# Altium schematic sheet Wheatstone bridge part I (Main).SchDoc: Wheatstone bridge part I
size A4; Revision: 1; SheetNumber: 3; SheetTotal: 5; Units: mm
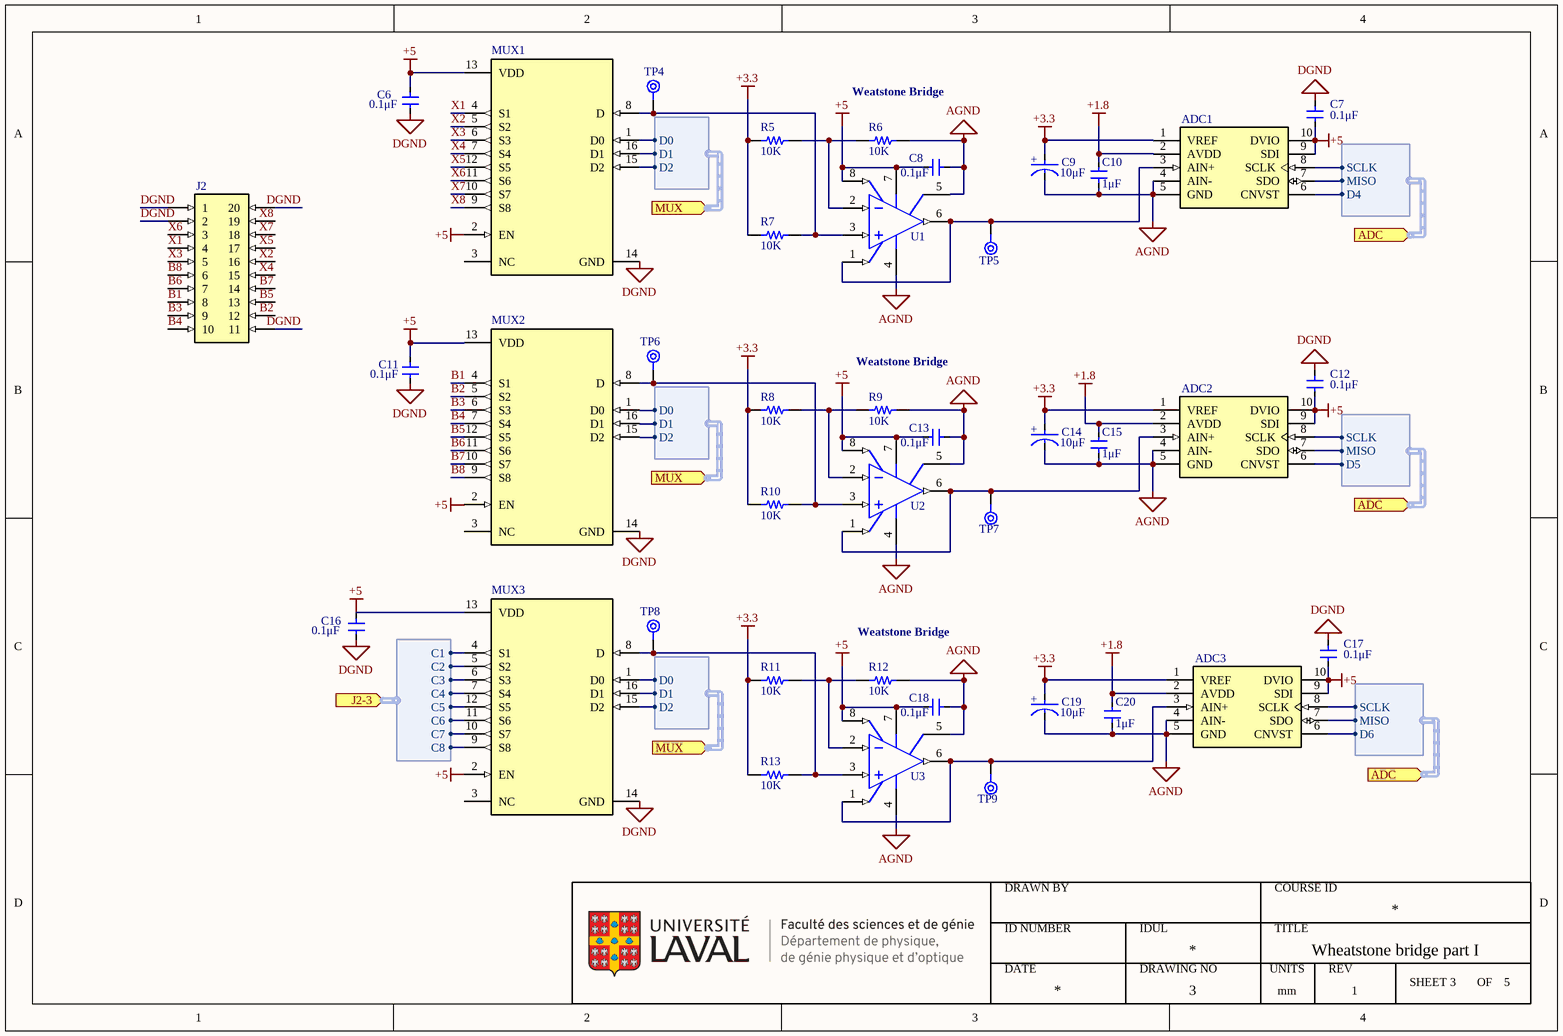
[diagram p0: Wheatstone bridge part I (Main).SchDoc]

## Parts
ADC1  (no value)  [MCP33141-10-E/MS]
ADC2  (no value)  [MCP33141-10-E/MS]
ADC3  (no value)  [MCP33141-10-E/MS]
C6  Capacitance: 0.1μF  [Cap Ceramic 0.1 uF 50V SMT 0603]  (hidden comment: CC0603JRX7R9BB104)
C7  Capacitance: 0.1μF  [Cap Ceramic 0.1 uF 50V SMT 0603]  (hidden comment: CC0603JRX7R9BB104)
C8  Capacitance: 0.1μF  [Cap Ceramic 0.1 uF 50V SMT 0603]  (hidden comment: CC0603JRX7R9BB104)
C9  value 10μF  [Cap Tantalum 10 uF 16V SMT 1411]  (hidden comment: Cap 10 uF 16V Tantalum 1411)
C10  value 1μF  [Cap Ceramic 1 uF 16V SMT 0603]  (hidden comment: CC0603KPX7R7BB105)
C11  Capacitance: 0.1μF  [Cap Ceramic 0.1 uF 50V SMT 0603]  (hidden comment: CC0603JRX7R9BB104)
C12  Capacitance: 0.1μF  [Cap Ceramic 0.1 uF 50V SMT 0603]  (hidden comment: CC0603JRX7R9BB104)
C13  Capacitance: 0.1μF  [Cap Ceramic 0.1 uF 50V SMT 0603]  (hidden comment: CC0603JRX7R9BB104)
C14  value 10μF  [Cap Tantalum 10 uF 16V SMT 1411]  (hidden comment: Cap 10 uF 16V Tantalum 1411)
C15  value 1μF  [Cap Ceramic 1 uF 16V SMT 0603]  (hidden comment: CC0603KPX7R7BB105)
C16  Capacitance: 0.1μF  [Cap Ceramic 0.1 uF 50V SMT 0603]  (hidden comment: CC0603JRX7R9BB104)
C17  Capacitance: 0.1μF  [Cap Ceramic 0.1 uF 50V SMT 0603]  (hidden comment: CC0603JRX7R9BB104)
C18  Capacitance: 0.1μF  [Cap Ceramic 0.1 uF 50V SMT 0603]  (hidden comment: CC0603JRX7R9BB104)
C19  value 10μF  [Cap Tantalum 10 uF 16V SMT 1411]  (hidden comment: Cap 10 uF 16V Tantalum 1411)
C20  value 1μF  [Cap Ceramic 1 uF 16V SMT 0603]  (hidden comment: CC0603KPX7R7BB105)
J2  BF050-20-A-B-0400-0300-L-G  [Headers 20 Pos TH 0.079" 4-3 - A]  (value not drawn)
MUX1  TMUX1208PWR  [TMUX1208PWR]  (value not drawn)
MUX2  TMUX1208PWR  [TMUX1208PWR]  (value not drawn)
MUX3  TMUX1208PWR  [TMUX1208PWR]  (value not drawn)
R5  value 10K  [Res 10K 0.1% SMT 0603]  (hidden comment: Res 10K SMT 0603)
R6  value 10K  [Res 10K 0.1% SMT 0603]  (hidden comment: Res 10K SMT 0603)
R7  value 10K  [Res 10K 0.1% SMT 0603]  (hidden comment: Res 10K SMT 0603)
R8  value 10K  [Res 10K 0.1% SMT 0603]  (hidden comment: Res 10K SMT 0603)
R9  value 10K  [Res 10K 0.1% SMT 0603]  (hidden comment: Res 10K SMT 0603)
R10  value 10K  [Res 10K 0.1% SMT 0603]  (hidden comment: Res 10K SMT 0603)
R11  value 10K  [Res 10K 0.1% SMT 0603]  (hidden comment: Res 10K SMT 0603)
R12  value 10K  [Res 10K 0.1% SMT 0603]  (hidden comment: Res 10K SMT 0603)
R13  value 10K  [Res 10K 0.1% SMT 0603]  (hidden comment: Res 10K SMT 0603)
TP4  Test Point  [SQ Pad]  (value not drawn)  (no BOM)
TP5  Test Point  [SQ Pad]  (value not drawn)  (no BOM)
TP6  Test Point  [SQ Pad]  (value not drawn)  (no BOM)
TP7  Test Point  [SQ Pad]  (value not drawn)  (no BOM)
TP8  Test Point  [SQ Pad]  (value not drawn)  (no BOM)
TP9  Test Point  [SQ Pad]  (value not drawn)  (no BOM)
U1  (no value)  [MCP6N11-100E/SN]
U2  (no value)  [MCP6N11-100E/SN]
U3  (no value)  [MCP6N11-100E/SN]

## Ports
ADC (in, harness 6), ADC (in, harness 7), ADC (in, harness 8), J2-3 (in, harness J2), MUX (in, harness 3), MUX (in, harness 4), MUX (in, harness 5)

## Harnesses
J2: C1, C2, C3, C4, C5, C6, C7, C8
4: D0, D1, D2
5: D0, D1, D2
3: D0, D1, D2
6: SCLK, MISO, D4
7: SCLK, MISO, D5
8: SCLK, MISO, D6

## Nets
+1.8: ADC1.2(AVDD) ADC2.2(AVDD) ADC3.2(AVDD) C10.1 C15.1 C20.1
+3.3: ADC1.1(VREF) ADC2.1(VREF) ADC3.1(VREF) C9.2(A) C14.2(A) C19.2(A) R5.1 R7.1 R8.1 R10.1 R11.1 R13.1
+5: ADC1.9(SDI) ADC1.10(DVIO) ADC2.9(SDI) ADC2.10(DVIO) ADC3.9(SDI) ADC3.10(DVIO) C6.2 C7.1 C8.1 C11.2 C12.1 C13.1 C16.2 C17.1 C18.1 MUX1.2(EN) MUX1.13(VDD) MUX2.2(EN) MUX2.13(VDD) MUX3.2(EN) MUX3.13(VDD) U1.7(VDD) U1.8(EN/~{CAL}) U2.7(VDD) U2.8(EN/~{CAL}) U3.7(VDD) U3.8(EN/~{CAL})
AGND: ADC1.4(AIN-) ADC1.5(GND) ADC2.4(AIN-) ADC2.5(GND) ADC3.4(AIN-) ADC3.5(GND) C8.2 C9.1(C) C10.2 C13.2 C14.1(C) C15.2 C18.2 C19.1(C) C20.2 R6.2 R9.2 R12.2 U1.4(VSS) U1.5(VREF) U2.4(VSS) U2.5(VREF) U3.4(VSS) U3.5(VREF)
DGND: C6.1 C7.2 C11.1 C12.2 C16.1 C17.2 J2.1 J2.2 J2.11 J2.20 MUX1.14(GND) MUX2.14(GND) MUX3.14(GND)
B1: J2.8 MUX2.4(S1)
B2: J2.12 MUX2.5(S2)
B3: J2.9 MUX2.6(S3)
B4: J2.10 MUX2.7(S4)
B5: J2.13 MUX2.12(S5)
B6: J2.7 MUX2.11(S6)
B7: J2.14 MUX2.10(S7)
B8: J2.6 MUX2.9(S8)
X1: J2.4 MUX1.4(S1)
X2: J2.16 MUX1.5(S2)
X3: J2.5 MUX1.6(S3)
X4: J2.15 MUX1.7(S4)
X5: J2.17 MUX1.12(S5)
X6: J2.3 MUX1.11(S6)
X7: J2.18 MUX1.10(S7)
X8: J2.19 MUX1.9(S8)
NetADC1_3: ADC1.3(AIN+) TP5.1(TP) U1.1(VFG) U1.6(VOUT)
NetADC1_6: ADC1.6(CNVST) ; port ADC.D4
NetADC1_7: ADC1.7(SDO) ADC2.7(SDO) ADC3.7(SDO) ; port ADC.MISO
NetADC1_8: ADC1.8(SCLK) ADC2.8(SCLK) ADC3.8(SCLK) ; port ADC.SCLK
NetADC2_3: ADC2.3(AIN+) TP7.1(TP) U2.1(VFG) U2.6(VOUT)
NetADC2_6: ADC2.6(CNVST) ; port ADC.D5
NetADC3_3: ADC3.3(AIN+) TP9.1(TP) U3.1(VFG) U3.6(VOUT)
NetADC3_6: ADC3.6(CNVST) ; port ADC.D6
NetMUX1_1: MUX1.1(D0) MUX2.1(D0) MUX3.1(D0) ; port MUX.D0
NetMUX1_8: MUX1.8(D) R7.2 TP4.1(TP) U1.3(VIP)
NetMUX1_15: MUX1.15(D2) MUX2.15(D2) MUX3.15(D2) ; port MUX.D2
NetMUX1_16: MUX1.16(D1) MUX2.16(D1) MUX3.16(D1) ; port MUX.D1
NetMUX2_8: MUX2.8(D) R10.2 TP6.1(TP) U2.3(VIP)
NetMUX3_4: MUX3.4(S1) ; port J2-3.C1
NetMUX3_5: MUX3.5(S2) ; port J2-3.C2
NetMUX3_6: MUX3.6(S3) ; port J2-3.C3
NetMUX3_7: MUX3.7(S4) ; port J2-3.C4
NetMUX3_8: MUX3.8(D) R13.2 TP8.1(TP) U3.3(VIP)
NetMUX3_9: MUX3.9(S8) ; port J2-3.C8
NetMUX3_10: MUX3.10(S7) ; port J2-3.C7
NetMUX3_11: MUX3.11(S6) ; port J2-3.C6
NetMUX3_12: MUX3.12(S5) ; port J2-3.C5
NetR5_2: R5.2 R6.1 U1.2(VIM)
NetR8_2: R8.2 R9.1 U2.2(VIM)
NetR11_2: R11.2 R12.1 U3.2(VIM)

Not connected (* = marked no-connect by the designer): MUX1 3(NC); MUX2 3(NC); MUX3 3(NC)

## Notes on the sheet
- (near R6) Weatstone Bridge
- (near R9) Weatstone Bridge
- (near R12) Weatstone Bridge
- DRAWN BY
- COURSE ID
- ID NUMBER
- DATE
- IDUL
- DRAWING NO
- TITLE
- UNITS
- REV
- SHEET
- OF
- (in symbol Cap 10 uF 16V Tantalum 1411) +

## Library data of the parts
ADC1-ADC3 = ADC 12 bits 1MSPS: 12 Bit Analog to Digital Converter 1 Input 1 SAR 10-MSOP; Supplier 1: Digi-Key; Supplier Part Number 1: MCP33141-10-E/MS-ND
C6-C8 C11-C13 C16-C18 = Cap Ceramic 0.1 uF SMT 0603: 0.1 µF ±5% 50V Ceramic Capacitor X7R 0603 (1608 Metric); manufacturer: Yageo; Part Number: CC0603JRX7R9BB104; Applications: General Purpose; componentlink1description: Datasheet; componentlink1url: https://www.yageo.com/upload/media/product/productsearch/datasheet/mlcc/UPY-GPHC_X7R_6.3V-to-50V_18.pdf; componentlink2description: DigiKey Link; componentlink2url: https://www.digikey.com/en/products/detail/yageo/CC0603JRX7R9BB104/5195188; Device Package: 0603 (1608 Metric); lastupdated: 2023-03-06 20:08:09; Lifecycle Status: Active; Minimum Order: 1; Mounting Type: Surface Mount, MLCC; Operating Temperature: -55°C ~ 125°C; Package / Case: 0603 (1608 Metric); packaging: TapeAndReel; partid: 12474; Part Status: Active; price: 0.01; series: CC; Size / Dimension: 0.063" L x 0.031" W (1.60mm x 0.80mm); Temperature Coefficient: X7R; Thickness (Max): 0.035" (0.90mm); Tolerance: ±5%; Voltage - Rated: 50V; Supplier 1: Digi-Key; Supplier Part Number 1: 311-1779-1-ND; Supplier 2: Digi-Key; Supplier Part Number 2: 311-1779-6-ND; Supplier 3: Digi-Key; Supplier Part Number 3: 311-1779-2-ND
C9 C14 C19 = Cap 10 uF 16V Tantalum 1411: 10 µF Molded Tantalum Capacitors 16 V 1411 (3528 Metric) 2Ohm; Voltage Rating: 16V; Case Code (Imperial): 1411; Supplier 1: Digi-Key; Supplier Part Number 1: 718-1124-1-ND; Supplier 2: Digi-Key; Supplier Part Number 2: 718-1124-6-ND; Supplier 3: Digi-Key; Supplier Part Number 3: 718-1124-2-ND
C10 C15 C20 = Cap Ceramic 1 uF SMT 0603: 1 µF ±10% 16V Ceramic Capacitor X7R 0603 (1608 Metric); Dielectric: XR7; Tolerance: 10%; Max Operating Temperature: 125°C; Case Code (Imperial): 0603; Voltage Rating (DC): 16V; Resistor Type: Ceramic; Height: 0.8mm; Length: 1.6mm; Construction: Flat; Termination: SMT/SMD; Min Operating Temperature: -55°C; Supplier 1: Digi-Key; Supplier Part Number 1: 13-CC0603KPX7R7BB105CT-ND; Supplier 2: Digi-Key; Supplier Part Number 2: 13-CC0603KPX7R7BB105DKR-ND; Supplier 3: Digi-Key; Supplier Part Number 3: 13-CC0603KPX7R7BB105TR-ND
J2 = Headers 20 Pos TH 0.079" 4-3: Connector Header Through Hole 20 position 0.079" (2.00mm); Supplier 1: Digi-Key; Supplier Part Number 1: 2073-BF050-20-A-B-0400-0300-L-G-ND
MUX1-MUX3 = MUX Analog 8:1: 5-V, 8: 1, 1-channel general-purpose analog multiplexer with 1.8-V input logic 16-TSSOP -40 to 125; Supplier 1: Digi-Key; Supplier Part Number 1: 296-51847-1-ND; Supplier 2: Digi-Key; Supplier Part Number 2: 296-51847-6-ND; Supplier 3: Digi-Key; Supplier Part Number 3: 296-51847-2-ND; ComponentLink1Description: Datasheet; ComponentLink1URL: https://www.ti.com/lit/ds/symlink/tmux1208.pdf?HQS=dis-dk-null-digikeymode-dsf-pf-null-wwe&ts=1678139087624&ref_url=https%253A%252F%252Fwww.ti.com%252Fgeneral%252Fdocs%252Fsuppproductinfo.tsp%253FdistId%253D10%2526gotoUrl%253Dhttps%253A%252F%252Fwww.ti.com%252Flit%252Fgpn%252Ftmux1208
R5-R13 = Res 10K SMT 0603: 10 kΩ  ±0.1% 0.1W, 1/10W Chip Resistor 0603 (1608 Metric) Thin Film; Part Number: RT0603BRD0710KL; Manufacturer: Yageo; Temperature Coefficient: ±25ppm/°C; ComponentLink1Description: Datasheet; ComponentLink1URL: https://www.yageo.com/upload/media/product/productsearch/datasheet/rchip/PYu-RT_1-to-0.01_RoHS_L_11.pdf; ComponentLink2Description: DigiKey Link; ComponentLink2URL: https://www.digikey.com/en/products/detail/yageo/RT0603BRD0710KL/1072198; Composition: Thin Film; Device Package: 0603 (1608 Metric); Height - Seated (Max): 0.022" (0.55mm); LastUpdated: 2023-03-06 20:27:57; Lifecycle Status: Active; Minimum Order: 1; Number of Terminations: 2; Operating Temperature: -55°C ~ 155°C; Package / Case: 0603 (1608 Metric); Packaging: TapeAndReel; PartId: 22611; Part Status: Active; Power (Watts): 0.1W, 1/10W; Price: 0.03; Resistance: 10K; Series: RT; Size / Dimension: 0.063" L x 0.031" W (1.60mm x 0.80mm); Supplier Device Package: 0603; Tolerance: ±0.1%; Supplier 1: Digi-Key; Supplier Part Number 1: YAG1236CT-ND; Supplier 2: Digi-Key; Supplier Part Number 2: YAG1236DKR-ND; Supplier 3: Digi-Key; Supplier Part Number 3: YAG1236TR-ND
U1-U3 = Instrumentation Op Amp 35 MHz 8 pins: Instrumentation Amplifier 1 Circuit Rail-to-Rail 8-SOIC; Supplier 1: Digi-Key; Supplier Part Number 1: MCP6N11-100E/SN-ND